# Altium schematic sheet Frequency_Sweeper.SchDoc
size B
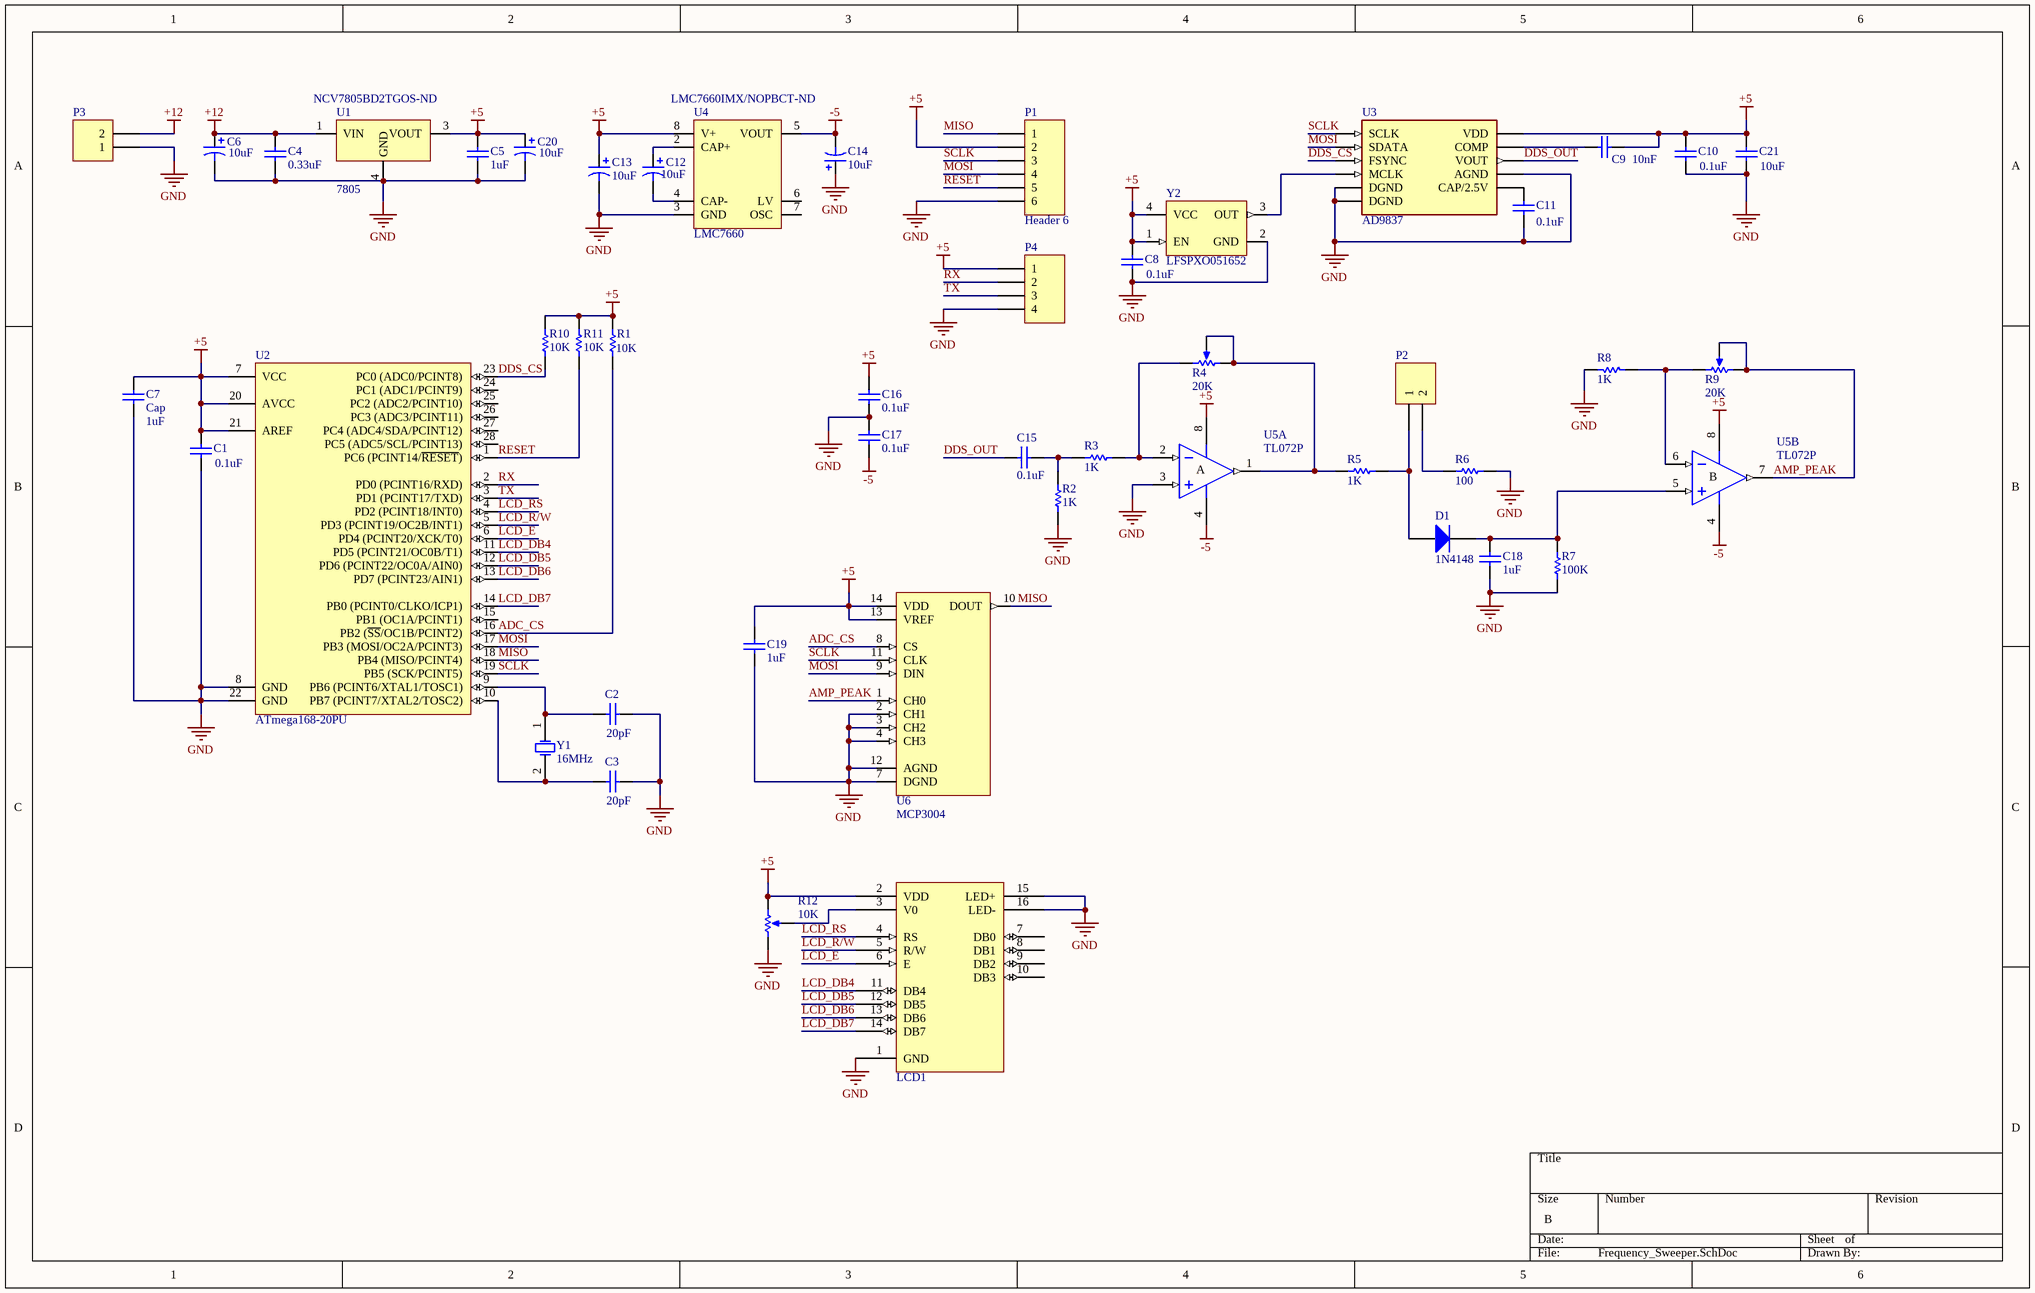
[diagram p0: Frequency_Sweeper.SchDoc]

## Parts
C1  value 0.1uF  [C0805]  (hidden comment: Cap)
C2  value 20pF  [C0805]  (hidden comment: Cap)
C3  value 20pF  [C0805]  (hidden comment: Cap)
C4  value 0.33uF  [C0805]  (hidden comment: Cap)
C5  value 1uF  [C0805]  (hidden comment: Cap)
C6  value 10uF  [CAP-D5]  (hidden comment: Cap Pol1)
C7  Cap  value 1uF  [C0805]
C8  value 0.1uF  [C0805]  (hidden comment: Cap)
C9  value 10nF  [C0805]  (hidden comment: Cap)
C10  value 0.1uF  [C0805]  (hidden comment: Cap)
C11  value 0.1uF  [C0805]  (hidden comment: Cap)
C12  value 10uF  [CAP-D5]  (hidden comment: Cap Pol1)
C13  value 10uF  [CAP-D5]  (hidden comment: Cap Pol1)
C14  value 10uF  [CAP-D5]  (hidden comment: Cap Pol1)
C15  value 0.1uF  [C0805]  (hidden comment: Cap)
C16  value 0.1uF  [C0805]  (hidden comment: Cap)
C17  value 0.1uF  [C0805]  (hidden comment: Cap)
C18  value 1uF  [C0805]  (hidden comment: Cap)
C19  value 1uF  [C0805]  (hidden comment: Cap)
C20  value 10uF  [CAP-D5]  (hidden comment: Cap Pol1)
C21  value 10uF  [C0805]  (hidden comment: Cap)
D1  1N4148  [DIODE-AXIAL-7.62]
LCD1  16-Pin LCD Display With Backlight  [HEADER-16X1]  (value not drawn)
P1  Header 6  [HDR2X3]
P2  Header 2  [HDR1X2]  (value not drawn)
P3  Header 2  [HDR1X2]  (value not drawn)
P4  Header 4  [HDR1X4]  (value not drawn)
R1  value 10K  [R0805]  (hidden comment: Res1)
R2  value 1K  [R0805]  (hidden comment: Res1)
R3  value 1K  [R0805]  (hidden comment: Res1)
R4  value 20K  [TRIMMER-2.54MM]  (hidden comment: RPot)
R5  value 1K  [R0805]  (hidden comment: Res1)
R6  value 100  [R0805]  (hidden comment: Res1)
R7  value 100K  [R0805]  (hidden comment: Res1)
R8  value 1K  [R0805]  (hidden comment: Res1)
R9  value 20K  [TRIMMER-2.54MM]  (hidden comment: RPot)
R10  value 10K  [R0805]  (hidden comment: Res1)
R11  value 10K  [R0805]  (hidden comment: Res1)
R12  value 10K  [TRIMMER-2.54MM]  (hidden comment: RPot)
U1  7805  Supplier Part Number 1: NCV7805BD2TGOS-ND  [TO-263_N]
U2  ATmega168-20PU  [28P3]
U3  AD9837  [LFCSP-10]
U4  LMC7660  Supplier Part Number 1: LMC7660IMX/NOPBCT-ND  [DIP-8]
U5  TL072P  [DIP-8]  (parts A,B of 2)
U6  MCP3004  [DIP-14]
Y1  16MHz  [HC-49-THT]
Y2  LFSPXO051652  [LFSPXO051652]

## Nets
+5: C1.2 C5.2 C7.2 C8.2 C9.1 C10.2 C13.1 C16.2 C19.2 C20.1 C21.2 LCD1.2(VDD) P1.2 P4.1 R1.2 R10.2 R11.2 R12.1(BOT) U1.3(VOUT) U2.7(VCC) U2.20(AVCC) U2.21(AREF) U3.2(VDD) U4.8(V+) U5.8(V+) U6.13(VREF) U6.14(VDD) Y2.1(EN) Y2.4(VCC)
+12: C4.2 C6.1 P3.2 U1.1(VIN)
-5: C14.2 C17.1 U4.5(VOUT) U5.4(V-)
GND: C1.1 C2.1 C3.1 C4.1 C5.1 C6.2 C7.1 C8.1 C10.1 C11.1 C13.2 C14.1 C16.1 C17.2 C18.1 C19.1 C20.2 C21.1 LCD1.1(GND) LCD1.15(LED+) LCD1.16(LED-) P1.6 P3.1 P4.4 R2.1 R6.1 R7.1 R8.1 R12.3(TOP) U1.4(GND) U2.8(GND) U2.22(GND) U3.0(DGND) U3.4(DGND) U3.9(AGND) U4.3(GND) U5.3(IN+) U6.2(CH1) U6.3(CH2) U6.4(CH3) U6.7(DGND) U6.12(AGND) Y2.2(GND)
ADC_CS: R1.1 U2.16(PB2_(~{SS}/OC1B/PCINT2)) U6.8(CS)
AMP_PEAK: R9.2(TAP) R9.3(TOP) U5.7(OUT) U6.1(CH0)
DDS_CS: R10.1 U2.23(PC0_(ADC0/PCINT8)) U3.8(FSYNC)
DDS_OUT: C15.2 U3.10(VOUT)
LCD_DB4: LCD1.11(DB4) U2.11(PD5_(PCINT21/OC0B/T1))
LCD_DB5: LCD1.12(DB5) U2.12(PD6_(PCINT22/OC0A/AIN0))
LCD_DB6: LCD1.13(DB6) U2.13(PD7_(PCINT23/AIN1))
LCD_DB7: LCD1.14(DB7) U2.14(PB0_(PCINT0/CLKO/ICP1))
LCD_E: LCD1.6(E) U2.6(PD4_(PCINT20/XCK/T0))
LCD_R/W: LCD1.5(R/W) U2.5(PD3_(PCINT19/OC2B/INT1))
LCD_RS: LCD1.4(RS) U2.4(PD2_(PCINT18/INT0))
MISO: P1.1 U2.18(PB4_(MISO/PCINT4)) U6.10(DOUT)
MOSI: P1.4 U2.17(PB3_(MOSI/OC2A/PCINT3)) U3.6(SDATA) U6.9(DIN)
RESET: P1.5 R11.1 U2.1(PC6_(PCINT14/~{RESET}))
RX: P4.2 U2.2(PD0_(PCINT16/RXD))
SCLK: P1.3 U2.19(PB5_(SCK/PCINT5)) U3.7(SCLK) U6.11(CLK)
TX: P4.3 U2.3(PD1_(PCINT17/TXD))
NetC2_2: C2.2 U2.9(PB6_(PCINT6/XTAL1/TOSC1)) Y1.1(OSC1)
NetC3_2: C3.2 U2.10(PB7_(PCINT7/XTAL2/TOSC2)) Y1.2(OSC2)
NetC9_2: C9.2 U3.1(COMP)
NetC11_2: C11.2 U3.3(CAP/2.5V)
NetC12_1: C12.1 U4.2(CAP+)
NetC12_2: C12.2 U4.4(CAP-)
NetC15_1: C15.1 R2.2 R3.1
NetC18_2: C18.2 D1.2(K) R7.2 U5.5(IN+)
NetD1_1: D1.1(A) P2.1 R5.1
NetLCD1_3: LCD1.3(V0) R12.2(TAP)
NetP2_2: P2.2 R6.2
NetR3_2: R3.2 R4.1(BOT) U5.2(IN-)
NetR4_2: R4.2(TAP) R4.3(TOP) R5.2 U5.1(OUT)
NetR8_2: R8.2 R9.1(BOT) U5.6(IN-)
NetU3_5: U3.5(MCLK) Y2.3(OUT)

Not connected (* = marked no-connect by the designer): LCD1 7(DB0) 8(DB1) 9(DB2) 10(DB3); U2 15(PB1_(OC1A/PCINT1)) 24(PC1_(ADC1/PCINT9)) 25(PC2_(ADC2/PCINT10)) 26(PC3_(ADC3/PCINT11)) 27(PC4_(ADC4/SDA/PCINT12)) 28(PC5_(ADC5/SCL/PCINT13)); U4 6(LV) 7(OSC)

## Notes on the sheet
- (in symbol TL072P, part A) A
- (in symbol TL072P, part B) B

## Library data of the parts
C1-C5 C7-C11 C15-C19 C21 = Cap: Capacitor; Published: 8-Jun-2000; LatestRevisionDate: 17-Jul-2002; LatestRevisionNote: Re-released for DXP Platform.; PackageReference: RAD-0.3; Publisher: Altium Limited; PackageDescription: Radial Cap, Thru-Hole; 2 Leads; 0.3 in Pin Spacing
  C1: Supplier 1: Digi-Key; Supplier Part Number 1: 399-1177-1-ND
  C2 C3: Supplier 1: Digi-Key; Supplier Part Number 1: 478-3735-1-ND
C6 C12-C14 C20 = Cap Pol1: Polarized Capacitor (Radial); Published: 8-Jun-2000; LatestRevisionDate: 17-Jul-2002; LatestRevisionNote: Re-released for DXP Platform.; PackageReference: RB7.6-15; Publisher: Altium Limited; PackageDescription: Polarized Capacitor (Radial); 2 Leads
D1 = Diode: Default Diode; Published: 8-Jun-2000; LatestRevisionDate: 17-Jul-2002; LatestRevisionNote: Re-released for DXP Platform.; PackageVersion: Sep-1996; PackageReference: SMC; Publisher: Altium Limited; PackageDescription: DO-214-AB/SMC; 2 C-Bend Leads; Body 7.9 x 5.9 mm, inc. leads (LxW); Code_JEDEC: DO-214-AB
LCD1 = LCD-16: pin to pad: 1>3 2>4 3>5 4>6 5>7 6>8 7>9 8>10 9>11 10>12 11>13 12>14 13>15 14>16 15>1 16>2
P1 = Header 6: Header, 6-Pin; LatestRevisionDate: 17-Jul-2002; LatestRevisionNote: Re-released for DXP Platform.; Publisher: Altium Limited
P2 P3 = Header 2: Header, 2-Pin; LatestRevisionDate: 17-Jul-2002; LatestRevisionNote: Re-released for DXP Platform.; Publisher: Altium Limited
P4 = Header 4: Header, 4-Pin; LatestRevisionDate: 17-Jul-2002; LatestRevisionNote: Re-released for DXP Platform.; Publisher: Altium Limited
R1-R3 R5-R8 R10 R11 = Res1: Resistor; Published: 8-Jun-2000; LatestRevisionDate: 17-Jul-2002; LatestRevisionNote: Re-released for DXP Platform.; PackageReference: AXIAL-0.3; Publisher: Altium Limited; PackageDescription: Axial Device, Thru-Hole; 2 Leads; 0.3 in Pin Spacing
  R1: Supplier 1: Digi-Key; Supplier Part Number 1: 311-10.0KCRCT-ND
R4 R9 R12 = RPot: Potentiometer; Sim Note: Enter the Resistance value and the set point into parameter fields.; Set Position: 0.5; Published: 8-Jun-2000; LatestRevisionDate: 17-Jul-2002; LatestRevisionNote: Re-released for DXP Platform.; PackageReference: VR5; Publisher: Altium Limited; PackageDescription: Variable Resistor, Thru-Hole; 3 Leads
U2 = CMP-0095-00363-1: 8-bit AVR Microcontroller, 2.7-5.5V, 20MHz, 16KB Flash, 512 Bytes EEPROM, 1KB SRAM, 28-pin PDIP, Industrial Grade (-40°C to 85°C); DatasheetVersion: revT, May-2011; ComponentLink2URL: http://www.atmel.com/dyn/resources/prod_documents/doc2545.pdf; PackageVersion: revB, Sep-2001; ComponentLink1URL: http://www.atmel.com/; PackageReference: 28P3; ComponentLink1Description: Manufacturer URL; ComponentLink2Description: ATmega48/88/168 Datasheet; PackageDescription: 28-lead (0.300"/7.62mm Wide) Plastic Dual Inline Package (PDIP); ComponentLink3URL: http://www.atmel.com/dyn/resources/prod_documents/2545S.pdf; ComponentLink3Description: ATmega48/88/168 Summary
U3 = AD9837: Direct Digital Synthesis IC 10 b 5MHz 28 b Tuning 10-LFCSP-WD (3x3); MF: Analog Devices; Value: *; Package: LFCSP-10 Analog Devices; SnapEDA_Link: https://www.snapeda.com/parts/AD9837/Analog%20Devices%20Inc./view-part/3230619/?ref=snap; Price: None; Availability: Unavailable; MP: AD9837
U5 = TL072P: Low-Noise JFET-Input Operational Amplifier; Published: 16-Jan-2001; LatestRevisionDate: 04-Mar-2005; LatestRevisionNote: Stylized 3D Model Added.; DatasheetVersion: Aug-1996; PackageVersion: Jun-1999; PackageReference: P008; Publisher: Altium Limited; PackageDescription: DIP; 8 Leads; Row Spacing 7.62 mm; Pitch 2.54 mm; Code_JEDEC: MO-001-AN; ComponentLink1Description: Manufacturer Link; ComponentLink1URL: http://www.ti.com/; ComponentLink2Description: Datasheet; ComponentLink2URL: http://www-s.ti.com/sc/ds/tl072.pdf
U6 = MCP3004: 4 Channel ADC SPI
Y1 = XTAL: Crystal Oscillator; Published: 8-Jun-2000; LatestRevisionDate: 17-Jul-2002; LatestRevisionNote: Re-released for DXP Platform.; PackageReference: R38; Publisher: Altium Limited; PackageDescription: Crystal, Thru-Hole; 2 Leads; Body 3.1 x 8.2 mm (Dia.xH); Supplier 1: Digi-Key; Supplier Part Number 1: X1103-ND
Y2 = OSC-4
U1 = 7805: Supplier 1: Digi-Key
U4 = LMC7660: Supplier 1: Digi-Key